# Altium schematic sheet ArduinoPromini.SchDoc
size A3 portrait
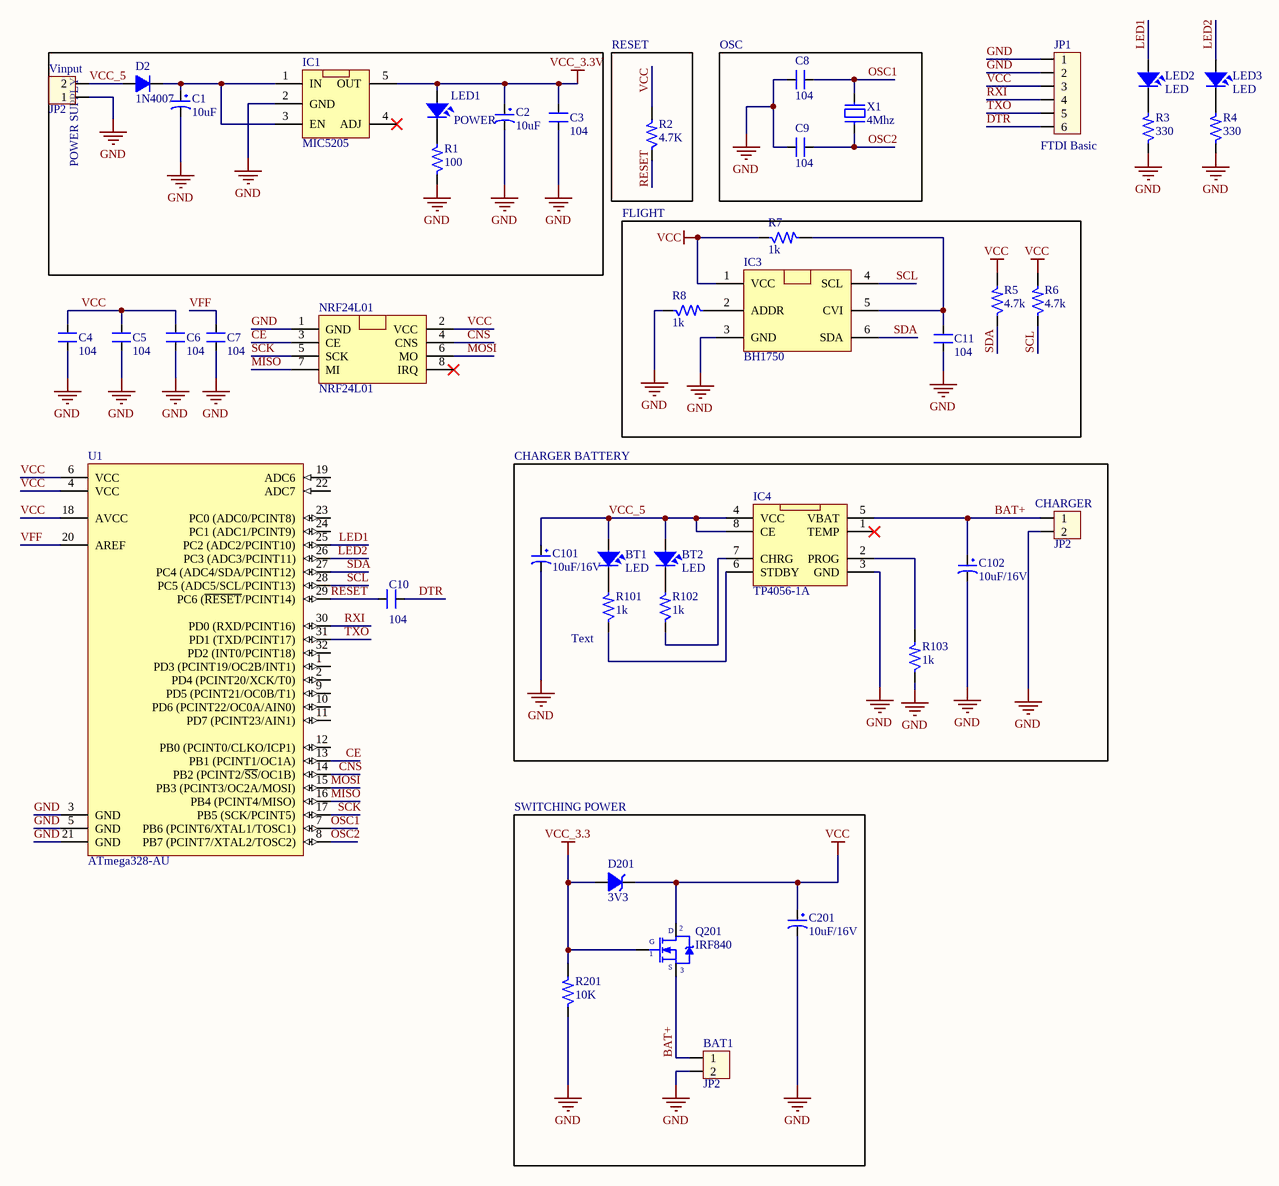
[diagram p0: ArduinoPromini.SchDoc]

## Parts
BAT1  JP2  [CON2]
BT1  LED  [LED-3]
BT2  LED  [LED-3]
C1  10uF  [CP1/2]
C2  10uF  [CP1/2]
C3  104  [CN2]
C4  104  [CN2]
C5  104  [CN2]
C6  104  [CN2]
C7  104  [CN2]
C8  104  [CN2]
C9  104  [CN2]
C10  104  [CN2]
C11  104  [CN2]
C101  10uF/16V  [CP1.5/3.4]
C102  10uF/16V  [CP1.5/3.4]
C201  10uF/16V  [CP1.5/3.4]
CHARGER  JP2  [CON2]
D2  1N4007  [D1A]
D201  3V3  [DZ0.5A]
IC1  MIC5205  [MIC5205]
IC3  BH1750  [BH1750]
IC4  TP4056-1A  [TP4056-1A]
JP1  FTDI Basic  [CON6]
LED1  POWER  [LED-3]
LED2  LED  [LED-3]
LED3  LED  [LED-3]
NRF24L01  NRF24L01  [NRF24L01]
Q201  IRF840  [QTO-220]
R1  100  [SM-1206]
R2  4.7K  [SM-1206]
R3  330  [SM-1206]
R4  330  [SM-1206]
R5  4.7k  [SM-1206]
R6  4.7k  [SM-1206]
R7  1k  [SM-1206]
R8  1k  [SM-1206]
R101  1k  [SM-1206]
R102  1k  [SM-1206]
R103  1k  [SM-1206]
R201  10K  [SM-1206]
U1  ATmega328-AU  [32A_N]
Vinput  JP2  [CON2]
X1  4Mhz  [XT2]

## Blocks framed on the sheet
POWER SUPPLY: C1-C3 D2 IC1 LED1 R1 Vinput
RESET: R2
OSC: C8 C9 X1
FLIGHT: C11 IC3 R5-R8
SWITCHING POWER: BAT1 C201 D201 Q201 R201

## Nets
GND: BAT1.2 C1.2 C2.2 C3.1 C4.1 C5.1 C6.1 C7.1 C8.2 C9.2 C11.1 C101.2 C102.2 C201.2 CHARGER.2 IC1.2(GND) IC3.3(GND) IC4.3(GND) JP1.1 JP1.2 NRF24L01.1(GND) R1.1 R3.1 R4.1 R8.1 R103.1 R201.1 U1.3(GND) U1.5(GND) U1.21(GND) Vinput.1
VCC: C4.2 C5.2 C6.2 C201.1 D201.2(K) IC3.1(VCC) JP1.3 NRF24L01.2(VCC) Q201.2(D) R2.2 R5.2 R6.2 R7.1 U1.4(VCC) U1.6(VCC) U1.18(AVCC)
VCC_3.3: D201.1(A) Q201.1(G) R201.2
VCC_3.3V: C2.1 C3.2 IC1.5(OUT) LED1.1
BAT+: BAT1.1 C102.1 CHARGER.1 IC4.5(VBAT) Q201.3(S)
CE: NRF24L01.3(CE) U1.13(PB1_(PCINT1/OC1A))
CNS: NRF24L01.4(CNS) U1.14(PB2_(PCINT2/~{SS}/OC1B))
DTR: C10.2 JP1.6
LED1: LED2.1 U1.25(PC2_(ADC2/PCINT10))
LED2: LED3.1 U1.26(PC3_(ADC3/PCINT11))
MISO: NRF24L01.7(MI) U1.16(PB4_(PCINT4/MISO))
MOSI: NRF24L01.6(MO) U1.15(PB3_(PCINT3/OC2A/MOSI))
OSC1: C8.1 U1.7(PB6_(PCINT6/XTAL1/TOSC1)) X1.2
OSC2: C9.1 U1.8(PB7_(PCINT7/XTAL2/TOSC2)) X1.1
RESET: C10.1 R2.1 U1.29(PC6_(~{RESET}/PCINT14))
RXI: JP1.4 U1.30(PD0_(RXD/PCINT16))
SCK: NRF24L01.5(SCK) U1.17(PB5_(SCK/PCINT5))
SCL: IC3.4(SCL) R6.1 U1.28(PC5_(ADC5/SCL/PCINT13))
SDA: IC3.6(SDA) R5.1 U1.27(PC4_(ADC4/SDA/PCINT12))
TXO: JP1.5 U1.31(PD1_(TXD/PCINT17))
VCC_5: BT1.1 BT2.1 C101.1 D2.1(A) IC4.4(VCC) IC4.8(CE) Vinput.2
VFF: C7.2 U1.20(AREF)
NetBT1_2: BT1.2 R101.2
NetBT2_2: BT2.2 R102.2
NetC1_1: C1.1 D2.2(K) IC1.1(IN) IC1.3(EN)
NetC11_2: C11.2 IC3.5(CVI) R7.2
NetIC3_2: IC3.2(ADDR) R8.2
NetIC4_2: IC4.2(PROG) R103.2
NetIC4_6: IC4.6(STDBY) R101.1
NetIC4_7: IC4.7(CHRG) R102.1
NetLED1_2: LED1.2 R1.2
NetLED2_2: LED2.2 R3.2
NetLED3_2: LED3.2 R4.2

Not connected (* = marked no-connect by the designer): IC1 4(ADJ)*; IC4 1(TEMP)*; NRF24L01 8(IRQ)*; U1 1(PD3_(PCINT19/OC2B/INT1)) 2(PD4_(PCINT20/XCK/T0)) 9(PD5_(PCINT21/OC0B/T1)) 10(PD6_(PCINT22/OC0A/AIN0)) 11(PD7_(PCINT23/AIN1)) 12(PB0_(PCINT0/CLKO/ICP1)) 19(ADC6) 22(ADC7) 23(PC0_(ADC0/PCINT8)) 24(PC1_(ADC1/PCINT9)) 32(PD2_(INT0/PCINT18))

## Notes on the sheet
- CHARGER BATTERY
- (near R101) Text
- Title
- Size:
- Date:
- A3
- Number:
- Time:
- Revision:
- Sheet
- of
- File:

## Library data of the parts
BAT1 CHARGER Vinput = Con2: Connector 2; Value: Connector 2
BT1 BT2 LED1-LED3 = LED: LED Single colour Green and Red; Value: LED 3 ly Single Colour
C1 C2 = CP1: Cap P  0,1uF < 22uF , 16 - 50V; Value: 10uF/50V; Description 1: 10 => 220uF/6,3V/10V - 10uF => 100uF/16V; Description 2: 0,1uF => 33uF/50V - 10uF => 22uF/63V; Description 3: 0,47uF => 10uF/100V
C3-C11 = CN2: Cap np 104 => 105pF; Value: 0.1uF
C101 C102 C201 = CP3: Cap 100uF/35V - 470uF/16V; Value: 100uF/35V/50V; Description 1: 1000uF/6,3V - 470uF/16V - 330uF - 25V; Description 2: 220uF/35V - 100uF/50V - 63V - 4,7uF/200V; Description 3: 22uF => 33uF100V - 3,3uF => 4,7uF/250V; Description 4: 2,2uF =>3,3uF/350 - 2,2uF/400V - 1uF/450V
D2 = D1A: Diode 1A; Value: 1N4007
D201 = DZ: Diode Zenner; Value: 3v3
JP1 = Con6: Connector 6; Value: Connector 6
Q201 = IRF840: MOSFET N - CHANNEL 500V - 0.75 - 8A - TO-220; Value: IRF840
R1-R8 R101-R103 R201 = R: Resistor 1/4W; Value: R1/4W - 1K
U1 = ATmega328-AU: 8-bit AVR Microcontroller, 32KB Flash, 1KB EEPROM, 2KB SRAM, 32-pin TQFP, Industrial Grade (-40°C to 85°C); Published: 1-Apr-2010; DatasheetVersion: revA, Jan-2010; PackageVersion: revB, Oct-2001; PackageReference: 32A; Publisher: Altium Limited; PackageDescription: 32-Lead, 7x7x1.0 mm Body, 0.8mm Lead Pitch, Thin Profile Plastic Quad Flat Package (TQFP); Supplier 1: Digi-Key; Supplier Part Number 1: ATMEGA328-AU-ND; Supplier 2: Mouser; Supplier Part Number 2: 556-ATMEGA328-AU; Code_JEDEC: MS-026-ABA; ComponentLink1Description: Manufacturer Link; ComponentLink1URL: http://www.atmel.com/products/avr/default.asp?; ComponentLink2Description: ATmega48A/48PA/88A/88PA/168A/168PA/328/328P Datasheet; ComponentLink2URL: http://www.atmel.com/dyn/resources/prod_documents/8271.pdf; ComponentLink3Description: ATmega48A/48PA/88A/88PA/168A/168PA/328/328P Summary; ComponentLink3URL: http://www.atmel.com/dyn/resources/prod_documents/8271S.pdf; ComponentLink4Description: Atmel.com Home; ComponentLink4URL: http://www.atmel.com
X1 = XT2: Crystal For all Crystal 2pin.; Value: 4Mhz